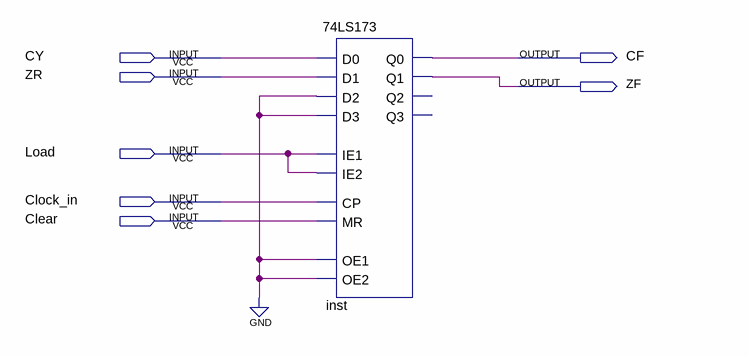
[diagram p0: schematic sheet]
// Quartus schematic Status_register.bdf as structural Verilog: 1 symbols, 7 pins
module Status_register (
  input  CY,
  input  ZR,
  input  Load,
  input  Clock_in,
  input  Clear,
  output CF,
  output ZF
);

  \74LS173  inst (
    .D0(CY), .D3(1'b0), .D1(ZR), .D2(1'b0), .IE1(Load), .IE2(Load), .CP(Clock_in), .MR(Clear), .OE1(1'b0),
    .OE2(1'b0), .Q0(CF), .Q1(ZF));  // open: Q2, Q3
endmodule
